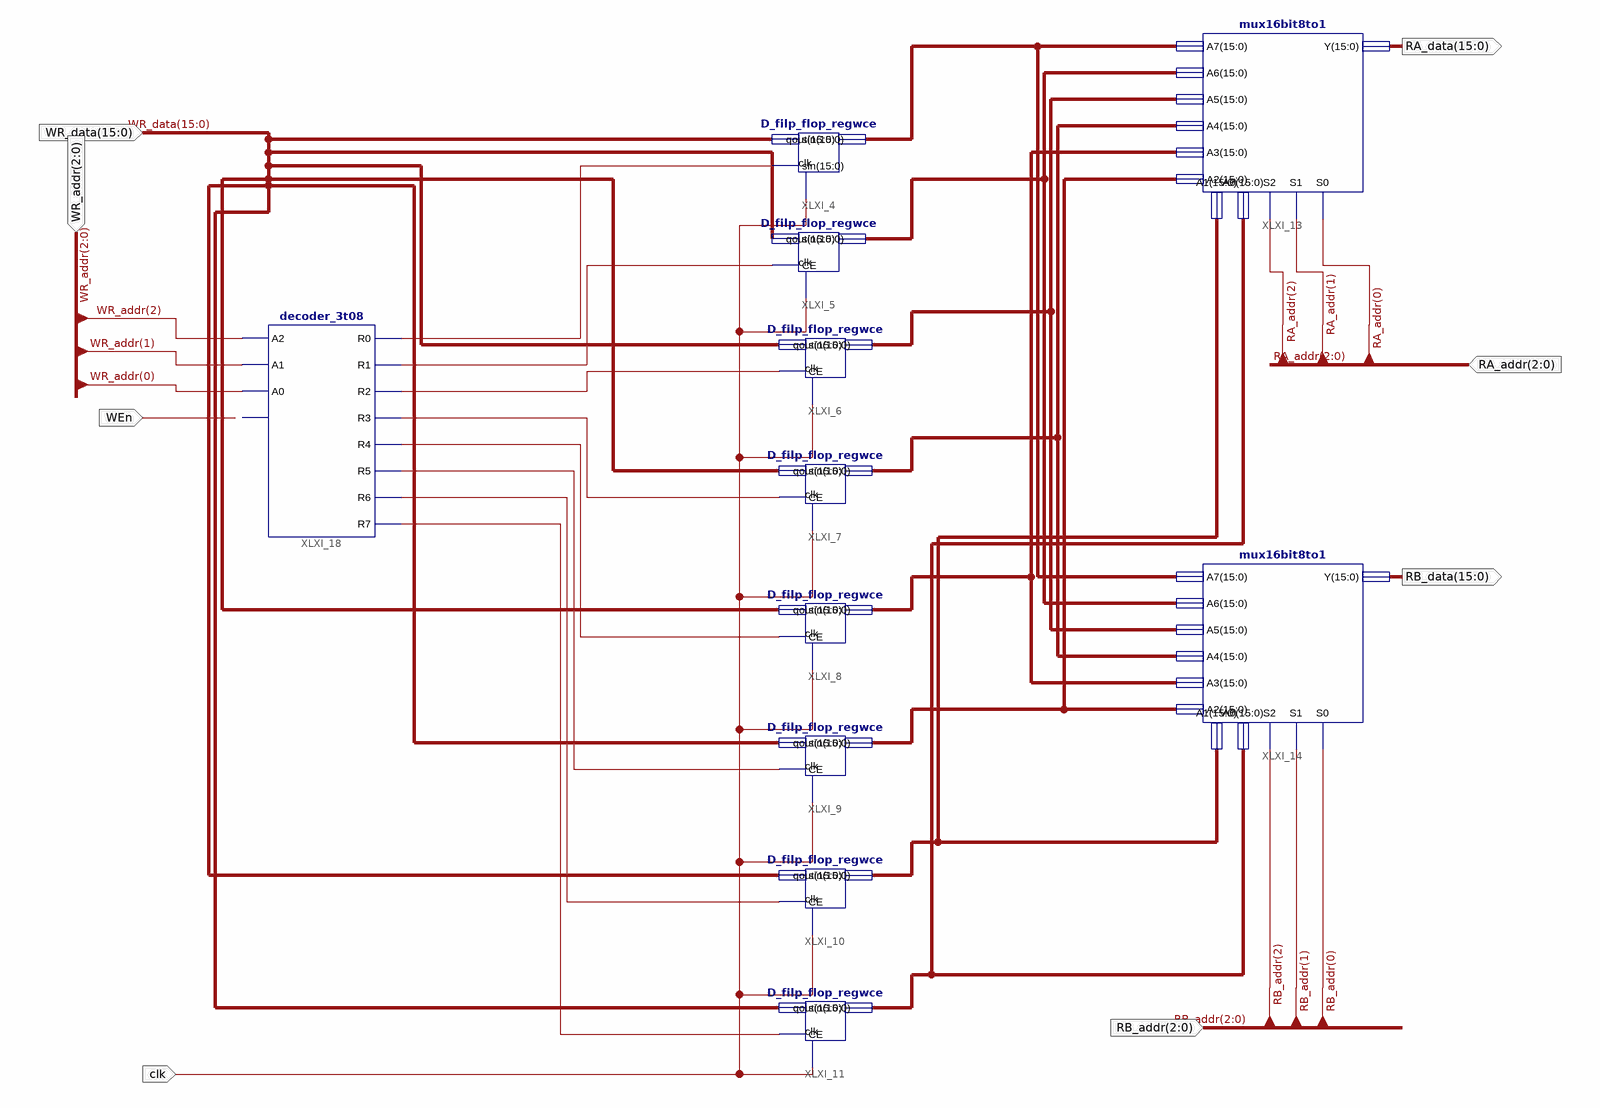
[diagram p0: schematic sheet 1]
// Xilinx ISE schematic regfile.sch (spartan3e) as structural Verilog: 11 symbols, 8 ports
module regfile (
  input  WEn,
  input  clk,
  input  [15:0] WR_data,
  input  [2:0] WR_addr,
  input  [2:0] RB_addr,
  input  [2:0] RA_addr,
  output [15:0] RB_data,
  output [15:0] RA_data
);

  wire XLXN_65, XLXN_67, XLXN_68, XLXN_69, XLXN_70, XLXN_71, XLXN_86, XLXN_87;
  wire [15:0] XLXN_34, XLXN_37, XLXN_39, XLXN_41, XLXN_43, XLXN_44, XLXN_46, XLXN_48;

  D_filp_flop_regwce XLXI_4 (.CE(XLXN_86), .clk(clk), .qout(XLXN_34), .sin(WR_data));
  D_filp_flop_regwce XLXI_5 (.CE(XLXN_65), .clk(clk), .qout(XLXN_37), .sin(WR_data));
  D_filp_flop_regwce XLXI_6 (.CE(XLXN_87), .clk(clk), .qout(XLXN_39), .sin(WR_data));
  D_filp_flop_regwce XLXI_7 (.CE(XLXN_67), .clk(clk), .qout(XLXN_41), .sin(WR_data));
  D_filp_flop_regwce XLXI_8 (.CE(XLXN_68), .clk(clk), .qout(XLXN_43), .sin(WR_data));
  D_filp_flop_regwce XLXI_9 (.CE(XLXN_69), .clk(clk), .qout(XLXN_44), .sin(WR_data));
  D_filp_flop_regwce XLXI_10 (.CE(XLXN_70), .clk(clk), .qout(XLXN_46), .sin(WR_data));
  D_filp_flop_regwce XLXI_11 (.CE(XLXN_71), .clk(clk), .qout(XLXN_48), .sin(WR_data));
  mux16bit8to1 XLXI_13 (
    .A7(XLXN_34), .A6(XLXN_37), .A5(XLXN_39), .A4(XLXN_41), .A3(XLXN_43), .A2(XLXN_44), .A1(XLXN_46),
    .A0(XLXN_48), .S2(RA_addr[2]), .S1(RA_addr[1]), .S0(RA_addr[0]), .Y(RA_data));
  mux16bit8to1 XLXI_14 (
    .A7(XLXN_34), .A6(XLXN_37), .A5(XLXN_39), .A4(XLXN_41), .A3(XLXN_43), .A2(XLXN_44), .A1(XLXN_46),
    .A0(XLXN_48), .S2(RB_addr[2]), .S1(RB_addr[1]), .S0(RB_addr[0]), .Y(RB_data));
  decoder_3t08 XLXI_18 (
    .A0(WR_addr[0]), .A1(WR_addr[1]), .A2(WR_addr[2]), .R0(XLXN_86), .R1(XLXN_65), .R2(XLXN_87),
    .R3(XLXN_67), .R4(XLXN_68), .R5(XLXN_69), .R6(XLXN_70), .R7(XLXN_71));  // open: Enable
endmodule
